# Altium schematic sheet PX2_Header.SchDoc
size 199 x 149 mm
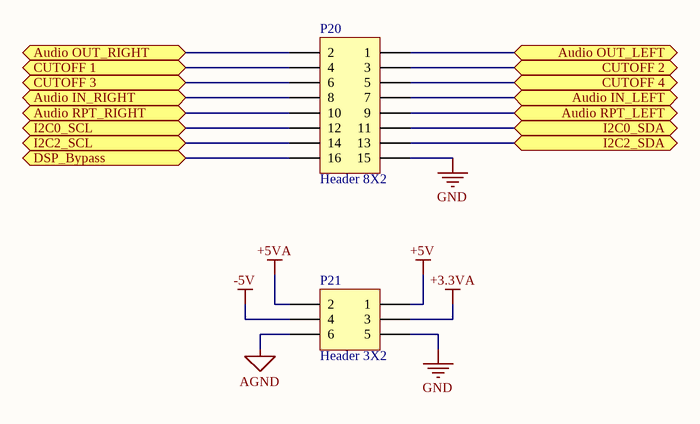
[diagram p0: PX2_Header.SchDoc]

## Parts
P20  Header 8X2  [CONN_1241050-8_T]
P21  Header 3X2  [CONN_1241050-3_T]

## Ports
Audio IN_LEFT, Audio IN_RIGHT, Audio OUT_LEFT, Audio OUT_RIGHT, Audio RPT_LEFT, Audio RPT_RIGHT, CUTOFF 1, CUTOFF 2, CUTOFF 3, CUTOFF 4, DSP_Bypass, I2C0_SCL, I2C0_SDA, I2C2_SCL, I2C2_SDA

## Nets
+3.3VA: P21.3
+5V: P21.1
+5VA: P21.2
-5V: P21.4
AGND: P21.6
GND: P20.15 P21.5
Audio IN_LEFT: P20.7 ; port Audio IN_LEFT
Audio IN_RIGHT: P20.8 ; port Audio IN_RIGHT
Audio OUT_LEFT: P20.1 ; port Audio OUT_LEFT
Audio OUT_RIGHT: P20.2 ; port Audio OUT_RIGHT
Audio RPT_LEFT: P20.9 ; port Audio RPT_LEFT
Audio RPT_RIGHT: P20.10 ; port Audio RPT_RIGHT
CUTOFF 1: P20.4 ; port CUTOFF 1
CUTOFF 2: P20.3 ; port CUTOFF 2
CUTOFF 3: P20.6 ; port CUTOFF 3
CUTOFF 4: P20.5 ; port CUTOFF 4
DSP_Bypass: P20.16 ; port DSP_Bypass
I2C0_SCL: P20.12 ; port I2C0_SCL
I2C0_SDA: P20.11 ; port I2C0_SDA
I2C2_SCL: P20.14 ; port I2C2_SCL
I2C2_SDA: P20.13 ; port I2C2_SDA

## Library data of the parts
P20 = Header 8X2: Header, 8-Pin, Dual row; Fabricant: SAMTEC; Fournisseur: Farnell; RefFabricant: TSM-108-02-T-DV; RefFournisseur: 2856657; DataSheet: http://www.farnell.com/datasheets/2186767.pdf
P21 = Header 3X2: Header, 3-Pin, Dual row; Fabricant: SAMTEC; Fournisseur: Farnell; RefFabricant: TSM-103-01-S-DV; RefFournisseur: 2667442; DataSheet: http://www.farnell.com/datasheets/318453.pdf